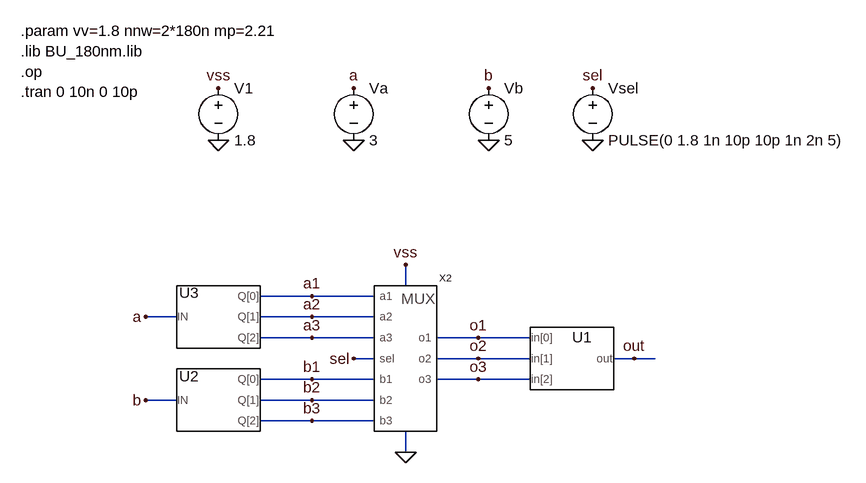
[diagram p0: schematic mux2x3b_test.asc]
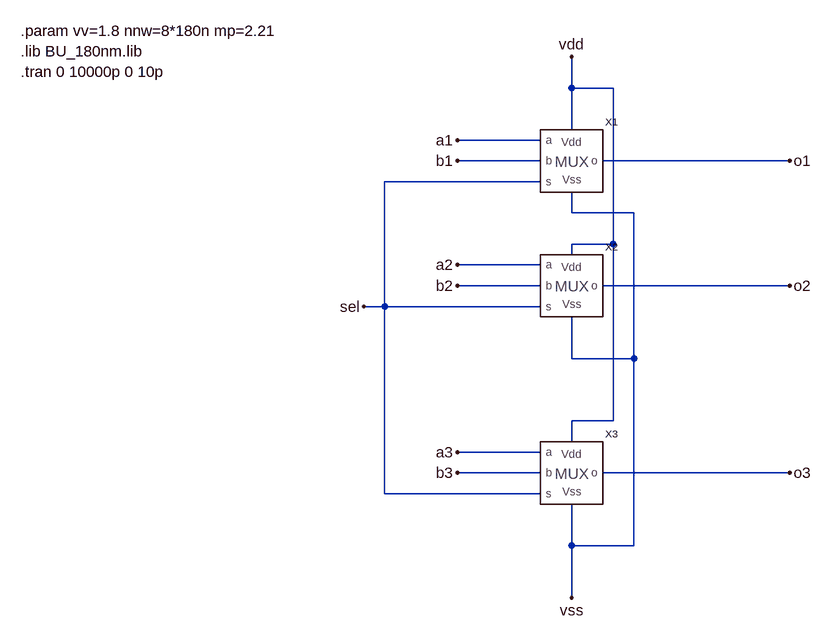
[diagram p1: sub-circuit mux2x3b.asc]
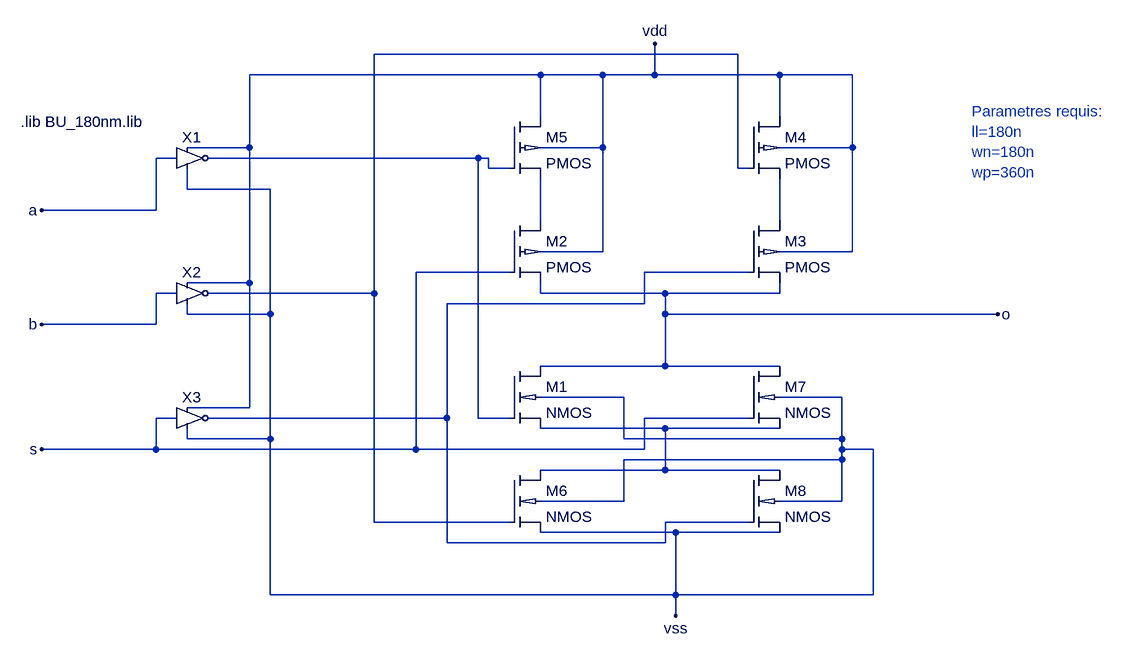
[diagram p2: sub-circuit mux2_1.asc]
mux2x3b_test.asc, the LTspice schematic file:
Version 4
SHEET 1 1132 680
WIRE 432 208 432 176
WIRE 288 224 208 224
WIRE 384 224 288 224
WIRE 80 256 32 256
WIRE 288 256 208 256
WIRE 384 256 288 256
WIRE 288 288 208 288
WIRE 384 288 288 288
WIRE 544 288 480 288
WIRE 624 288 544 288
WIRE 384 320 352 320
WIRE 544 320 480 320
WIRE 624 320 544 320
WIRE 784 320 752 320
WIRE 816 320 784 320
WIRE 288 352 208 352
WIRE 384 352 288 352
WIRE 544 352 480 352
WIRE 624 352 544 352
WIRE 80 384 32 384
WIRE 288 384 208 384
WIRE 384 384 288 384
WIRE 288 416 208 416
WIRE 384 416 288 416
WIRE 432 464 432 432
FLAG 784 320 out
FLAG 432 176 vss
FLAG 432 464 0
FLAG 144 -16 0
FLAG 352 -16 0
FLAG 560 -16 0
FLAG 144 -96 vss
FLAG 352 -96 a
FLAG 560 -96 b
FLAG 32 256 a
FLAG 32 384 b
FLAG 720 -16 0
FLAG 720 -96 sel
FLAG 544 288 o1
FLAG 544 320 o2
FLAG 544 352 o3
FLAG 288 224 a1
FLAG 288 256 a2
FLAG 288 288 a3
FLAG 288 352 b1
FLAG 288 384 b2
FLAG 288 416 b3
FLAG 352 320 sel
SYMBOL Bin2Dec 688 320 R0
SYMATTR InstName U1
SYMATTR SpiceLine Vhigh={vv}
SYMBOL Dec2Bin 144 384 R0
SYMATTR InstName U2
SYMATTR SpiceLine Vhigh={vv}
SYMBOL Dec2Bin 144 256 R0
SYMATTR InstName U3
SYMATTR SpiceLine Vhigh={vv}
SYMBOL /voltage 144 -112 R0
SYMATTR InstName V1
SYMATTR Value 1.8
SYMBOL /voltage 352 -112 R0
SYMATTR InstName Va
SYMATTR Value 3
SYMBOL /voltage 560 -112 R0
SYMATTR InstName Vb
SYMATTR Value 5
SYMBOL /voltage 720 -112 R0
WINDOW 123 0 0 Left 0
WINDOW 39 0 0 Left 0
SYMATTR InstName Vsel
SYMATTR Value PULSE(0 1.8 1n 10p 10p 1n 2n 5)
SYMBOL mux2x3b 432 320 R0
SYMATTR InstName X2
TEXT -160 -184 Left 2 !.param vv=1.8 nnw=2*180n mp=2.21\n.lib BU_180nm.lib\n.op\n.tran 0 10n 0 10p

mux2x3b.asc, the sub-circuit schematic file:
Version 4
SHEET 1 1628 1032
WIRE 1248 112 1248 64
WIRE 1312 112 1248 112
WIRE 1248 176 1248 112
WIRE 1200 192 1072 192
WIRE 1200 224 1072 224
WIRE 1584 224 1296 224
WIRE 1200 256 960 256
WIRE 1248 304 1248 272
WIRE 1344 304 1248 304
WIRE 1312 352 1312 112
WIRE 1312 352 1248 352
WIRE 1248 368 1248 352
WIRE 1200 384 1072 384
WIRE 1200 416 1072 416
WIRE 1584 416 1296 416
WIRE 960 448 960 256
WIRE 960 448 928 448
WIRE 1200 448 960 448
WIRE 1248 528 1248 464
WIRE 1344 528 1344 304
WIRE 1344 528 1248 528
WIRE 1312 624 1312 352
WIRE 1312 624 1248 624
WIRE 1248 656 1248 624
WIRE 1200 672 1072 672
WIRE 1200 704 1072 704
WIRE 1584 704 1296 704
WIRE 960 736 960 448
WIRE 1200 736 960 736
WIRE 1248 816 1248 752
WIRE 1344 816 1344 528
WIRE 1344 816 1248 816
WIRE 1248 896 1248 816
FLAG 928 448 sel
FLAG 1248 64 vdd
FLAG 1584 224 o1
FLAG 1584 416 o2
FLAG 1584 704 o3
FLAG 1072 192 a1
FLAG 1072 384 a2
FLAG 1072 672 a3
FLAG 1072 224 b1
FLAG 1072 416 b2
FLAG 1072 704 b3
FLAG 1248 896 vss
SYMBOL mux2_1 1200 272 R0
SYMATTR InstName X1
SYMATTR SpiceLine ll=180n wn={nnw} wp={nnw*mp}
SYMBOL mux2_1 1200 464 R0
SYMATTR InstName X2
SYMATTR SpiceLine ll=180n wn={nnw} wp={nnw*mp}
SYMBOL mux2_1 1200 752 R0
SYMATTR InstName X3
SYMATTR SpiceLine ll=180n wn={nnw} wp={nnw*mp}
TEXT 400 24 Left 2 !.param vv=1.8 nnw=8*180n mp=2.21\n.lib BU_180nm.lib\n.tran 0 10000p 0 10p

mux2_1.asc, the sub-circuit schematic file:
Version 4
SHEET 1 1192 916
WIRE 448 -32 -112 -32
WIRE 144 0 -304 0
WIRE 240 0 144 0
WIRE 320 0 320 -48
WIRE 320 0 240 0
WIRE 512 0 320 0
WIRE 624 0 512 0
WIRE 144 64 144 0
WIRE 512 64 512 0
WIRE -304 112 -304 0
WIRE -304 112 -400 112
WIRE 240 112 240 0
WIRE 240 112 144 112
WIRE 624 112 624 0
WIRE 624 112 512 112
WIRE -416 128 -448 128
WIRE 48 128 -368 128
WIRE 64 128 48 128
WIRE 64 144 64 128
WIRE 96 144 64 144
WIRE 448 144 448 -32
WIRE 464 144 448 144
WIRE -400 176 -400 144
WIRE -272 176 -400 176
WIRE -448 208 -448 128
WIRE -448 208 -624 208
WIRE 144 224 144 160
WIRE 512 224 512 160
WIRE 240 272 240 112
WIRE 240 272 144 272
WIRE 624 272 624 112
WIRE 624 272 512 272
WIRE 96 304 -48 304
WIRE 464 304 304 304
WIRE -304 320 -304 112
WIRE -304 320 -400 320
WIRE -416 336 -448 336
WIRE -112 336 -112 -32
WIRE -112 336 -368 336
WIRE 144 336 144 320
WIRE 336 336 144 336
WIRE 512 336 512 320
WIRE 512 336 336 336
WIRE 304 352 304 304
WIRE 304 352 0 352
WIRE -400 368 -400 352
WIRE -272 368 -272 176
WIRE -272 368 -400 368
WIRE 336 368 336 336
WIRE 848 368 336 368
WIRE -448 384 -448 336
WIRE -448 384 -624 384
WIRE 336 448 336 368
WIRE 336 448 144 448
WIRE 512 448 336 448
WIRE 272 496 144 496
WIRE 608 496 512 496
WIRE -304 512 -304 320
WIRE -304 512 -400 512
WIRE -416 528 -448 528
WIRE 0 528 0 352
WIRE 0 528 -368 528
WIRE 48 528 48 128
WIRE 96 528 48 528
WIRE 464 528 304 528
WIRE 336 544 144 544
WIRE 512 544 336 544
WIRE -400 560 -400 544
WIRE -272 560 -272 368
WIRE -272 560 -400 560
WIRE 272 560 272 496
WIRE 608 560 608 496
WIRE 608 560 272 560
WIRE -448 576 -448 528
WIRE -448 576 -624 576
WIRE -48 576 -48 304
WIRE -48 576 -448 576
WIRE 304 576 304 528
WIRE 304 576 -48 576
WIRE 608 576 608 560
WIRE 656 576 608 576
WIRE 608 592 608 576
WIRE 608 592 272 592
WIRE 336 608 336 544
WIRE 336 608 144 608
WIRE 512 608 336 608
WIRE 272 656 272 592
WIRE 272 656 144 656
WIRE 608 656 608 592
WIRE 608 656 512 656
WIRE -112 688 -112 336
WIRE 96 688 -112 688
WIRE 464 688 336 688
WIRE 352 704 144 704
WIRE 512 704 352 704
WIRE 0 720 0 528
WIRE 336 720 336 688
WIRE 336 720 0 720
WIRE -272 800 -272 560
WIRE 352 800 352 704
WIRE 352 800 -272 800
WIRE 656 800 656 576
WIRE 656 800 352 800
WIRE 352 832 352 800
FLAG -624 208 a
FLAG -624 384 b
FLAG 352 832 vss
FLAG 320 -48 vdd
FLAG 848 368 o
FLAG -624 576 s
SYMBOL pmos018 464 224 R0
SYMATTR InstName M3
SYMATTR Value2 l={ll} w={wp} ad={450n*{wp}} as={450n*{wp}} pd={900n+{wp}} ps={1080n+{wp}}
SYMBOL pmos018 464 64 R0
SYMATTR InstName M4
SYMATTR Value2 l={ll} w={wp} ad={450n*{wp}} as={450n*{wp}} pd={900n+{wp}} ps={1080n+{wp}}
SYMBOL pmos018 96 64 R0
SYMATTR InstName M5
SYMATTR Value2 l={ll} w={wp} ad={450n*{wp}} as={450n*{wp}} pd={900n+{wp}} ps={1080n+{wp}}
SYMBOL nmos018 96 608 R0
SYMATTR InstName M6
SYMATTR Value2 l={ll} w={wn} ad={450n*{wn}} as={450n*{wn}} pd={900n+{wn}} ps={1080n+{wn}}
SYMBOL nmos018 464 448 R0
SYMATTR InstName M7
SYMATTR Value2 l={ll} w={wn} ad={450n*{wn}} as={450n*{wn}} pd={900n+{wn}} ps={1080n+{wn}}
SYMBOL nmos018 464 608 R0
SYMATTR InstName M8
SYMATTR Value2 l={ll} w={wn} ad={450n*{wn}} as={450n*{wn}} pd={900n+{wn}} ps={1080n+{wn}}
SYMBOL inv -400 128 R0
SYMATTR InstName X1
SYMATTR SpiceLine ll=180n wn={nnw} wp={nnw*mp}
SYMBOL inv -400 336 R0
SYMATTR InstName X2
SYMATTR SpiceLine ll=180n wn={nnw} wp={nnw*mp}
SYMBOL nmos018 96 448 R0
SYMATTR InstName M1
SYMATTR Value2 l={ll} w={wn} ad={450n*{wn}} as={450n*{wn}} pd={900n+{wn}} ps={1080n+{wn}}
SYMBOL pmos018 96 224 R0
SYMATTR InstName M2
SYMATTR Value2 l={ll} w={wp} ad={450n*{wp}} as={450n*{wp}} pd={900n+{wp}} ps={1080n+{wp}}
SYMBOL inv -400 528 R0
SYMATTR InstName X3
SYMATTR SpiceLine ll=180n wn={nnw} wp={nnw*mp}
TEXT -656 72 Left 2 !.lib BU_180nm.lib
TEXT 808 56 Left 2 ;Parametres requis: \nll=180n\nwn=180n  \nwp=360n

The netlist it stands for:
* mux2x3b_test.asc
XU1 o1 o2 o3 out Bin2Dec Vhigh={vv}  ; pins in[0] in[1] in[2] out
XU2 b b1 b2 b3 Dec2Bin Vhigh={vv}  ; pins IN Q[0] Q[1] Q[2]
XU3 a a1 a2 a3 Dec2Bin Vhigh={vv}  ; pins IN Q[0] Q[1] Q[2]
V1 vss 0 1.8
Va a 0 3
Vb b 0 5
Vsel sel 0 PULSE(0 1.8 1n 10p 10p 1n 2n 5)
XX2 vss a1 a2 a3 b1 b2 b3 0 o1 o2 o3 sel mux2x3b

* block symbol definitions
.subckt mux2x3b vdd a1 a2 a3 b1 b2 b3 vss o1 o2 o3 sel
XX1 a1 b1 sel o1 vdd vss mux2_1 params: ll=180n wn={nnw} wp={nnw*mp}
XX2 a2 b2 sel o2 vdd vss mux2_1 params: ll=180n wn={nnw} wp={nnw*mp}
XX3 a3 b3 sel o3 vdd vss mux2_1 params: ll=180n wn={nnw} wp={nnw*mp}
.param vv=1.8 nnw=8*180n mp=2.21
.lib BU_180nm.lib
.tran 0 10000p 0 10p
.ends mux2x3b

.subckt mux2_1 a b s o Vdd Vss
M3 N004 N005 o vdd PMOS l={ll} w={wp} ad={450n*{wp}} as={450n*{wp}} pd={900n+{wp}} ps={1080n+{wp}}
M4 vdd N001 N004 vdd PMOS l={ll} w={wp} ad={450n*{wp}} as={450n*{wp}} pd={900n+{wp}} ps={1080n+{wp}}
M5 vdd N002 N003 vdd PMOS l={ll} w={wp} ad={450n*{wp}} as={450n*{wp}} pd={900n+{wp}} ps={1080n+{wp}}
M6 N006 N001 vss vss NMOS l={ll} w={wn} ad={450n*{wn}} as={450n*{wn}} pd={900n+{wn}} ps={1080n+{wn}}
M7 o s N006 vss NMOS l={ll} w={wn} ad={450n*{wn}} as={450n*{wn}} pd={900n+{wn}} ps={1080n+{wn}}
M8 N006 N005 vss vss NMOS l={ll} w={wn} ad={450n*{wn}} as={450n*{wn}} pd={900n+{wn}} ps={1080n+{wn}}
XX1 a N002 vdd vss inv ll=180n wn={nnw} wp={nnw*mp}  ; pins In _Q vdd vss
XX2 b N001 vdd vss inv ll=180n wn={nnw} wp={nnw*mp}  ; pins In _Q vdd vss
M1 o N002 N006 vss NMOS l={ll} w={wn} ad={450n*{wn}} as={450n*{wn}} pd={900n+{wn}} ps={1080n+{wn}}
M2 N003 s o vdd PMOS l={ll} w={wp} ad={450n*{wp}} as={450n*{wp}} pd={900n+{wp}} ps={1080n+{wp}}
XX3 s N005 vdd vss inv ll=180n wn={nnw} wp={nnw*mp}  ; pins In _Q vdd vss
.lib BU_180nm.lib
* Parametres requis:
* ll=180n
* wn=180n
* wp=360n
.ends mux2_1

.model NMOS NMOS
.model PMOS PMOS
.lib standard.mos
.param vv=1.8 nnw=2*180n mp=2.21
.lib BU_180nm.lib
.op
.tran 0 10n 0 10p
.lib Bin2Dec.sub
.lib Dec2Bin.sub
.lib mux2x3b.asc
.lib BU_180nm.lib
.backanno
.end